# Altium schematic sheet FPGA_PART1.SchDoc
size 420 x 297 mm; SheetNumber: 29; SheetTotal: 32
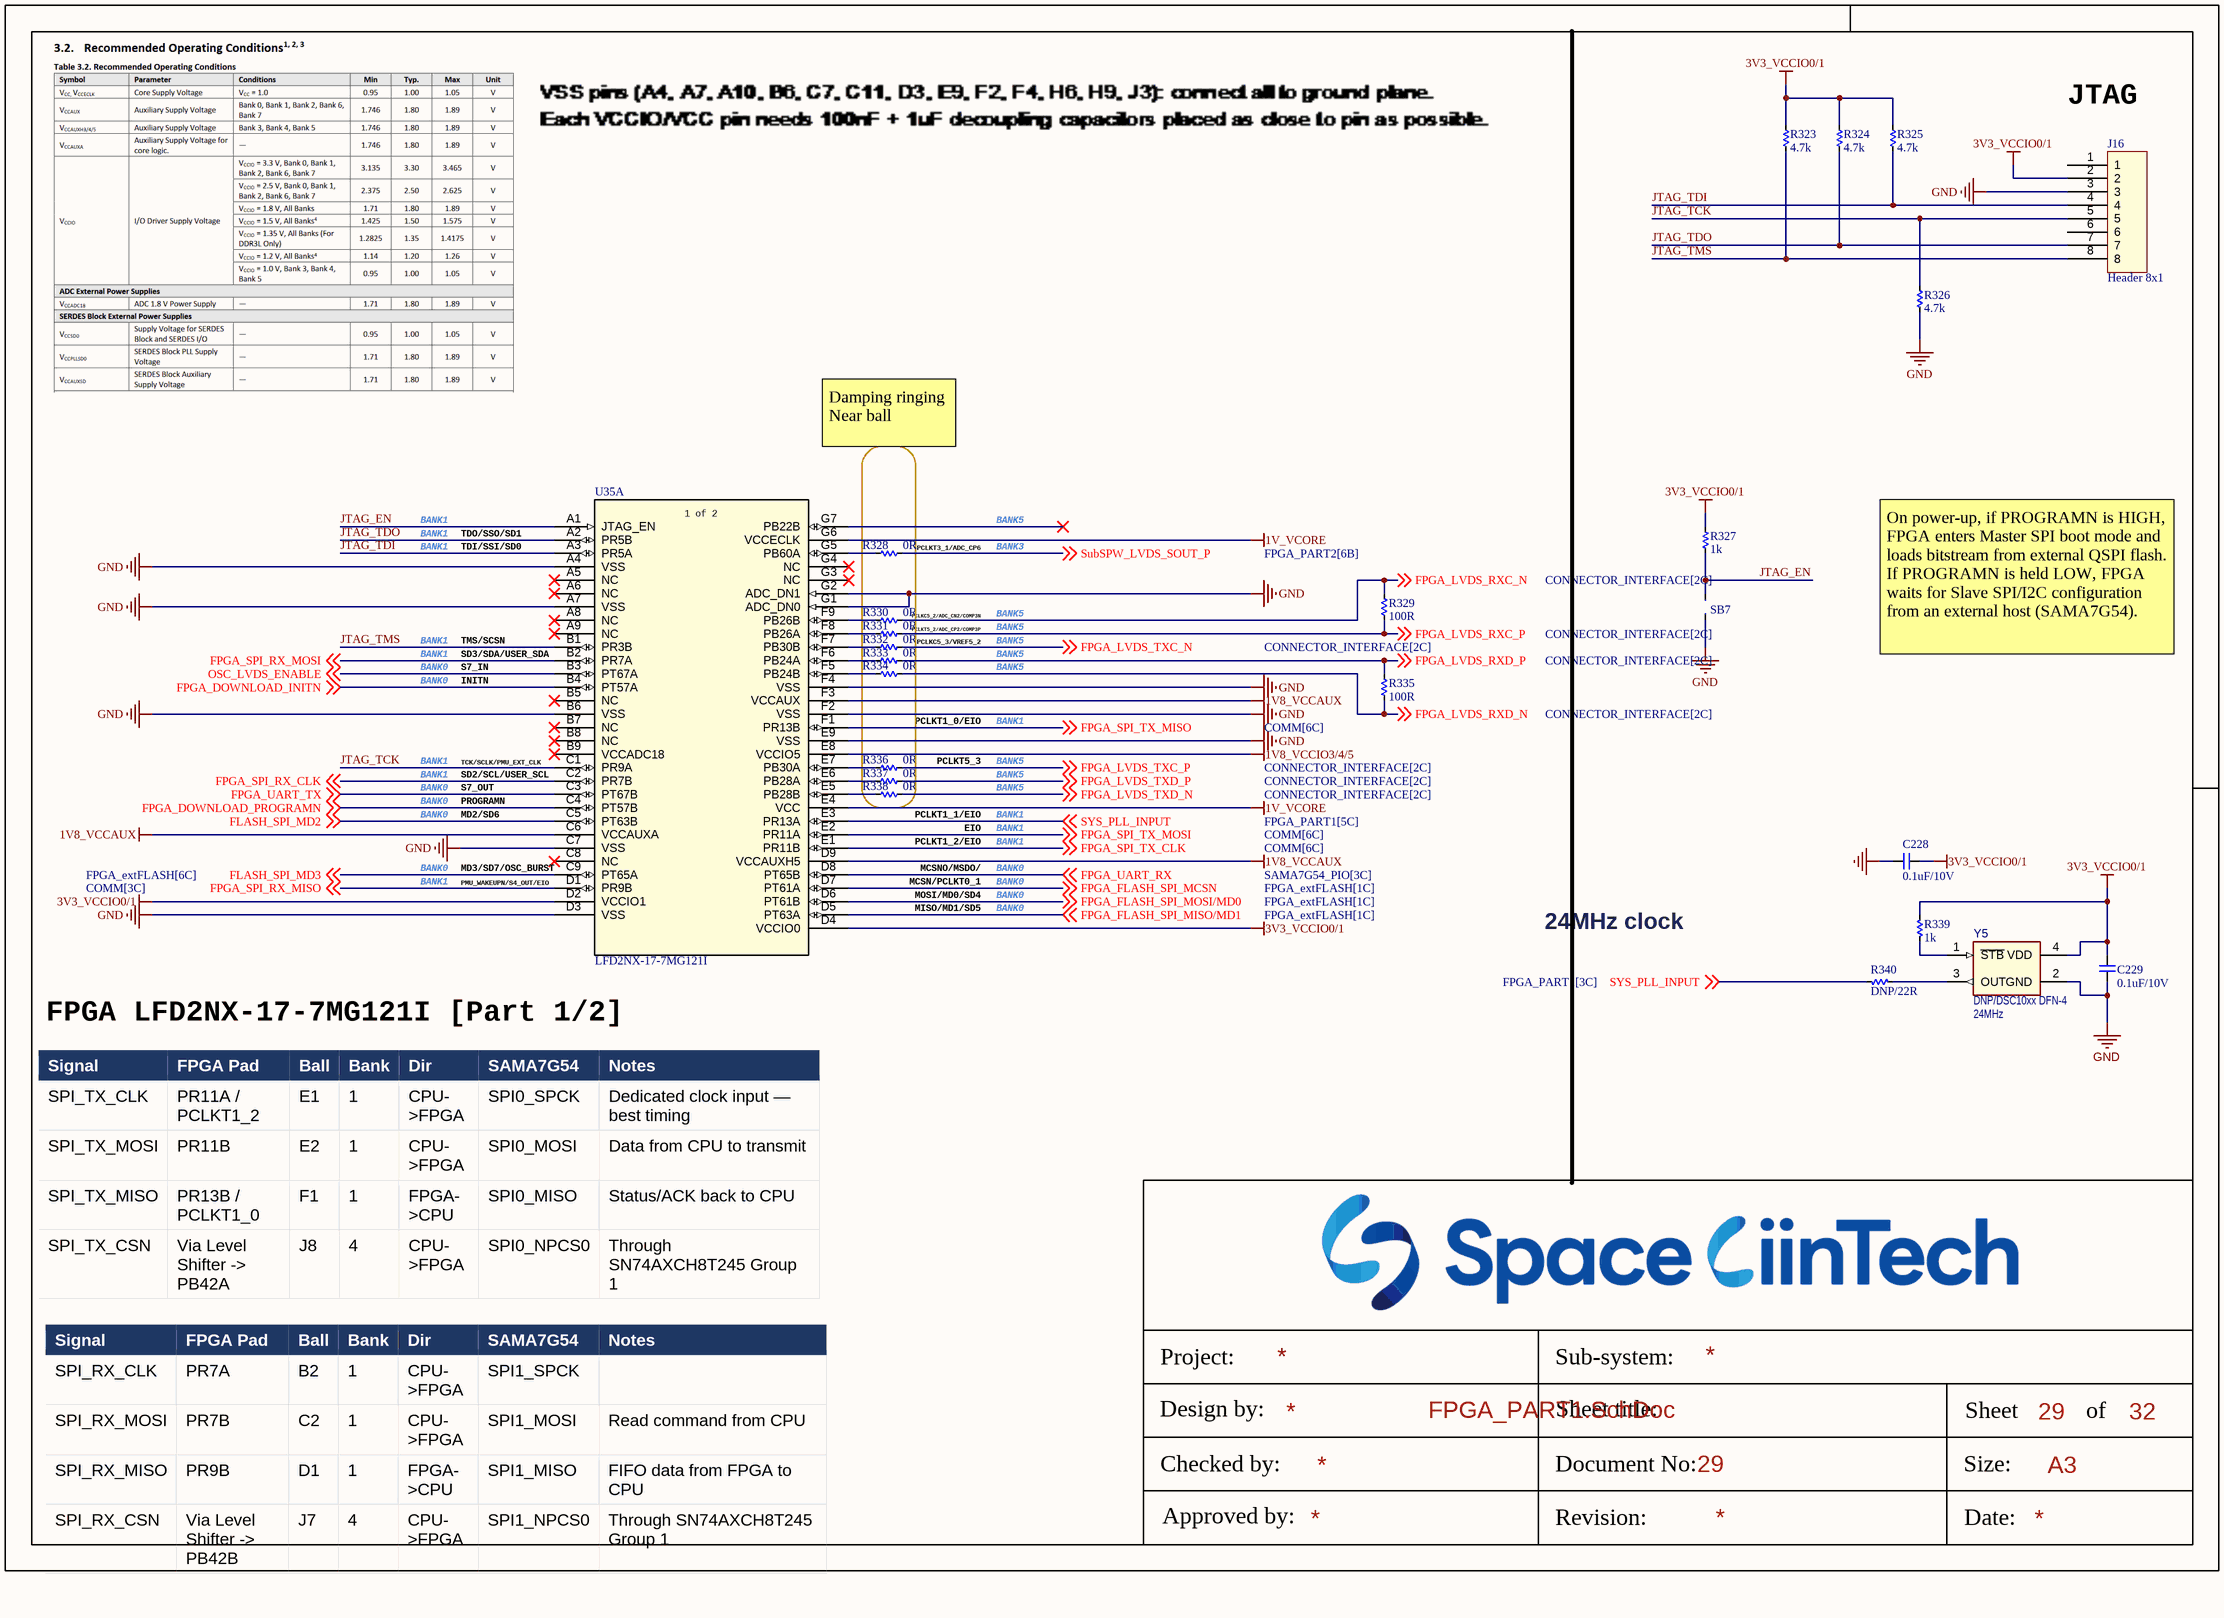
[diagram p0: FPGA_PART1.SchDoc]

## Parts
C228  0.1uF/10V  [CAP_C_1005X50_L]
C229  0.1uF/10V  [CAP_C_1005X50_L]
J16  Header 8x1  [SAMTEC_TSM-108-01-L-SV-P-TR]
R323  4.7k  [RES_C_1005x30_L]
R324  4.7k  [RES_C_1005x30_L]
R325  4.7k  [RES_C_1005x30_L]
R326  4.7k  [RES_C_1005x30_L]
R327  1k  [RES_C_1005x30_L]
R328  0R  [RES_C_1005x30_L]
R329  100R  [RES_C_1005x30_L]
R330  0R  [RES_C_1005x30_L]
R331  0R  [RES_C_1005x30_L]
R332  0R  [RES_C_1005x30_L]
R333  0R  [RES_C_1005x30_L]
R334  0R  [RES_C_1005x30_L]
R335  100R  [RES_C_1005x30_L]
R336  0R  [RES_C_1005x30_L]
R337  0R  [RES_C_1005x30_L]
R338  0R  [RES_C_1005x30_L]
R339  1k  [RES_C_1005x30_L]
R340  DNP/22R  [RES_C_1005x30_L]
SB7  JUMPER  [JUMPER_1608]  (value not drawn)
U35  LFD2NX-17-7MG121I  [csfBGA121_LAT]  (part A of 2)
Y5  DNP/DSC10xx DFN-4  value 24MHz  [DFN-4_2.5x2]

## Nets
1V8_VCCAUX: U35.C6(VCCAUXA) U35.D9(VCCAUXH5) U35.F3(VCCAUX)
1V8_VCCIO3/4/5: U35.E8(VCCIO5)
1V_VCORE: U35.E4(VCC) U35.G6(VCCECLK)
3V3_VCCIO0/1: C228.2 C229.2 J16.2 R323.2 R324.2 R325.2 R327.2 R339.2 U35.D2(VCCIO1) U35.D4(VCCIO0) Y5.4(VDD)
GND: C228.1 C229.1 J16.3 R326.1 SB7.1 U35.A4(VSS) U35.A7(VSS) U35.B6(VSS) U35.C7(VSS) U35.D3(VSS) U35.E9(VSS) U35.F2(VSS) U35.F4(VSS) U35.G1(ADC_DN0) U35.G2(ADC_DN1) Y5.2(GND)
FLASH_SPI_MD2: U35.C5(PT63B) ; off-sheet FLASH_SPI_MD2
FLASH_SPI_MD3: U35.C9(PT65A) ; off-sheet FLASH_SPI_MD3
FPGA_DOWNLOAD_INITN: U35.B4(PT57A) ; off-sheet FPGA_DOWNLOAD_INITN
FPGA_DOWNLOAD_PROGRAMN: U35.C4(PT57B) ; off-sheet FPGA_DOWNLOAD_PROGRAMN
FPGA_FLASH_SPI_MCSN: U35.D7(PT61A) ; off-sheet FPGA_FLASH_SPI_MCSN
FPGA_FLASH_SPI_MISO/MD1: U35.D5(PT63A) ; off-sheet FPGA_FLASH_SPI_MISO/MD1
FPGA_FLASH_SPI_MOSI/MD0: U35.D6(PT61B) ; off-sheet FPGA_FLASH_SPI_MOSI/MD0
FPGA_LVDS_RXC_N: R329.1 R330.1 ; off-sheet FPGA_LVDS_RXC_N
FPGA_LVDS_RXC_P: R329.2 R331.1 ; off-sheet FPGA_LVDS_RXC_P
FPGA_LVDS_RXD_N: R334.1 R335.2 ; off-sheet FPGA_LVDS_RXD_N
FPGA_LVDS_RXD_P: R333.1 R335.1 ; off-sheet FPGA_LVDS_RXD_P
FPGA_LVDS_TXC_N: R332.1 ; off-sheet FPGA_LVDS_TXC_N
FPGA_LVDS_TXC_P: R336.1 ; off-sheet FPGA_LVDS_TXC_P
FPGA_LVDS_TXD_N: R338.1 ; off-sheet FPGA_LVDS_TXD_N
FPGA_LVDS_TXD_P: R337.1 ; off-sheet FPGA_LVDS_TXD_P
FPGA_SPI_RX_CLK: U35.C2(PR7B) ; off-sheet FPGA_SPI_RX_CLK
FPGA_SPI_RX_MISO: U35.D1(PR9B) ; off-sheet FPGA_SPI_RX_MISO
FPGA_SPI_RX_MOSI: U35.B2(PR7A) ; off-sheet FPGA_SPI_RX_MOSI
FPGA_SPI_TX_CLK: U35.E1(PR11B) ; off-sheet FPGA_SPI_TX_CLK
FPGA_SPI_TX_MISO: U35.F1(PR13B) ; off-sheet FPGA_SPI_TX_MISO
FPGA_SPI_TX_MOSI: U35.E2(PR11A) ; off-sheet FPGA_SPI_TX_MOSI
FPGA_UART_RX: U35.D8(PT65B) ; off-sheet FPGA_UART_RX
FPGA_UART_TX: U35.C3(PT67B) ; off-sheet FPGA_UART_TX
JTAG_EN: R327.1 SB7.2 U35.A1(JTAG_EN)
JTAG_TCK: J16.5 R326.2 U35.C1(PR9A)
JTAG_TDI: J16.4 R325.1 U35.A3(PR5A)
JTAG_TDO: J16.7 R324.1 U35.A2(PR5B)
JTAG_TMS: J16.8 R323.1 U35.B1(PR3B)
OSC_LVDS_ENABLE: U35.B3(PT67A) ; off-sheet OSC_LVDS_ENABLE
SubSPW_LVDS_SOUT_P: R328.1 ; off-sheet SubSPW_LVDS_SOUT_P
SYS_PLL_INPUT: R340.2 U35.E3(PR13A) ; off-sheet SYS_PLL_INPUT
NetR328_2: R328.2 U35.G5(PB60A)
NetR330_2: R330.2 U35.F9(PB26B)
NetR331_2: R331.2 U35.F8(PB26A)
NetR332_2: R332.2 U35.F7(PB30B)
NetR333_2: R333.2 U35.F6(PB24A)
NetR334_2: R334.2 U35.F5(PB24B)
NetR336_2: R336.2 U35.E7(PB30A)
NetR337_2: R337.2 U35.E6(PB28A)
NetR338_2: R338.2 U35.E5(PB28B)
NetR339_1: R339.1 Y5.1(~{STB})
NetR340_1: R340.1 Y5.3(OUT)

Not connected (* = marked no-connect by the designer): J16 1 6; U35 A5(NC)* A6(NC)* A8(NC)* A9(NC)* B5(NC)* B7(NC)* B8(NC)* B9(VCCADC18)* C8(NC)* G3(NC)* G4(NC)* G7(PB22B)*

## Notes on the sheet
- JTAG
- Damping ringing
  Near ball
- BANK1
- BANK5
- TDO/SSO/SD1
- TDI/SSI/SD0
- (near R328) PCLKT3_1/ADC_CP6
- BANK3
- TMS/SCSN
- SD3/SDA/USER_SDA
- PCLKC5_3/VREF5_2
- PCLKT5_2/ADC_CP2/COMP3P
- PCLKC5_2/ADC_CN2/COMP3N
- On power-up, if PROGRAMN is HIGH, FPGA enters Master SPI boot mode and loads bitstream from external QSPI flash. If PROGRAMN is held LOW, FPGA waits for Slave SPI/I2C configuration from an external host (SAMA7G54).
- BANK0
- S7_IN
- INITN
- PCLKT1_0/EIO
- TCK/SCLK/PMU_EXT_CLK
- SD2/SCL/USER_SCL
- S7_OUT
- PCLKT5_3
- PROGRAMN
- MD2/SD6
- PCLKT1_2/EIO
- EIO
- PCLKT1_1/EIO
- (near U35) MD3/SD7/OSC_BURST
- PMU_WAKEUPN/S4_OUT/EIO
- MISO/MD1/SD5
- MOSI/MD0/SD4
- MCSN/PCLKT0_1
- MCSNO/MSDO/
- 24MHz clock
- FPGA LFD2NX-17-7MG121I [Part 1/2]
- Project:
- Sub-system:
- Design by:
- Sheet title:
- Sheet
- A3
- of
- Checked by:
- Approved by:
- Revision:
- Document No:
- Size:
- Date:
- (in symbol LFD2NX-17-7MG121I, part A) 1 of 2

## Library data of the parts
C228 C229 = _CAP_C_2: CAP
R323-R340 = _RES_B_2: RES
U35 = LFD2NX-17-7MG121I: Description; Manufacturer_Name: Lattice; Type: Embedded; Copyright: Copyright (C) 2025 Ultra Librarian. All rights reserved.; Manufacturer_Part_Number: LFD2NX-17-7MG121I; RefDes: RefDes
Y5 = MIC6659: Manufacturer 1: Microchip Technology; Manufacturer Part Number 1: DSC1001DI5-024.0000T; Description_: MCHP CLOCK OSCILLATOR SINGLE 24MHz DSC1001DI5-024.0000 SMD-2520; Dev Tools Status: Design; Owner: Maurizio Gavardoni; Populated: YES; MCHP-ID: MIC6659; Revision: A; Symbol: DSC10xx DFN-4; Status: MCL Design; ComponentLink1Description: SVN Datasheet; ComponentLink2Description: Local Datasheet; ComponentLink3URL: C:\ALTIUM_WORK\00001_MCHP-CDB\Library\LibraryRefs\DSC10xx DFN-4.SchLib; ComponentLink3Description: Open Symbol; ComponentLink4URL: C:\ALTIUM_WORK\00001_MCHP-CDB\Library\Footprints\DFN-4_2.5x2.PcbLib; ComponentLink4Description: Open Footprint; ComponentLink5Description: Open Footprint 2; ComponentLink6Description: Open Footprint 3; ComponentLink7Description: Open Footprint 4; Category: MCHP-Clock/Timing; Type: Oscillator; Supplier 1: Digi-Key; Supplier Part Number 1: DSC1001DI5-024.0000T-ND; Quantity Override: 1